# EAGLE design Adafruit UDA1334 I2S DAC (EAGLE 6.4)
COMPANY: ADAFRUIT INDUSTRIES; DRAWN: KTOWN; REV: A; YEAR: 2017
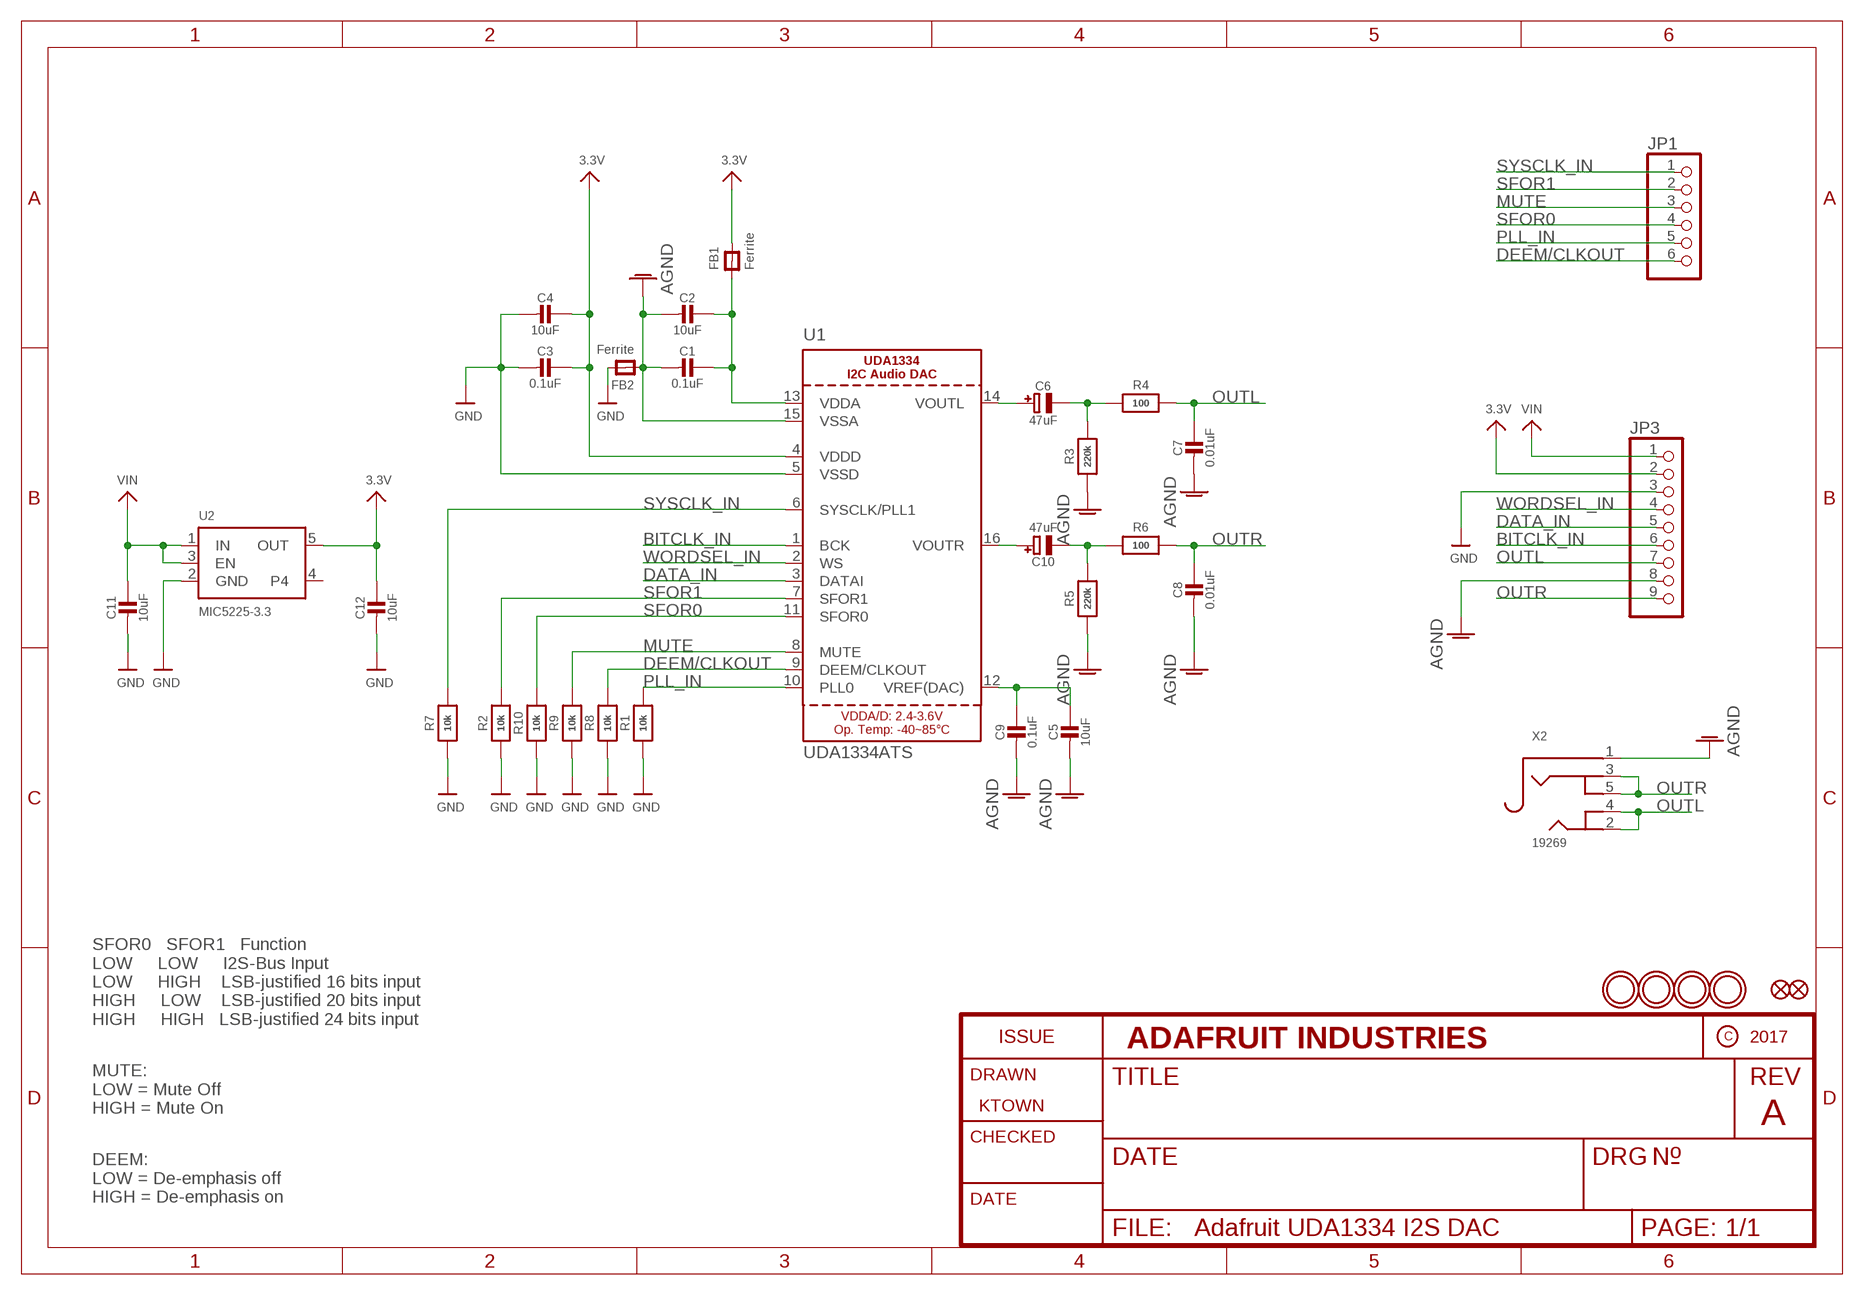
[diagram p0: schematic, sheet 1]

## Parts
C1  0.1uF  CAP_CERAMIC0805-NOOUTLINE  [0805-NO]
C2  10uF  CAP_CERAMIC0805-NOOUTLINE  [0805-NO]
C3  0.1uF  CAP_CERAMIC0805-NOOUTLINE  [0805-NO]
C4  10uF  CAP_CERAMIC0805-NOOUTLINE  [0805-NO]
C5  10uF  CAP_CERAMIC0805-NOOUTLINE  [0805-NO]
C6  47uF  CAP_ELECTROLYTICPANASONIC_C  [PANASONIC_C]
C7  0.01uF  CAP_CERAMIC0805-NOOUTLINE  [0805-NO]
C8  0.01uF  CAP_CERAMIC0805-NOOUTLINE  [0805-NO]
C9  0.1uF  CAP_CERAMIC0805-NOOUTLINE  [0805-NO]
C10  47uF  CAP_ELECTROLYTICPANASONIC_C  [PANASONIC_C]
C11  10uF  CAP_CERAMIC0805-NOOUTLINE  [0805-NO]
C12  10uF  CAP_CERAMIC0805-NOOUTLINE  [0805-NO]
FB1  Ferrite  FERRITE0805  [0805]
FB2  Ferrite  FERRITE0805  [0805]
FID1  FIDUCIAL_1MM  [FIDUCIAL_1MM]
FID2  FIDUCIAL_1MM  [FIDUCIAL_1MM]
JP1  HEADER-1X670MIL  [1X06_ROUND_70]
JP3  HEADER-1X970MIL  [1X09_ROUND_70]
R1  10k  RESISTOR_0603_NOOUT  [0603-NO]
R2  10k  RESISTOR_0603_NOOUT  [0603-NO]
R3  220k  RESISTOR0805_NOOUTLINE  [0805-NO]
R4  100  RESISTOR0805_NOOUTLINE  [0805-NO]
R5  220k  RESISTOR0805_NOOUTLINE  [0805-NO]
R6  100  RESISTOR0805_NOOUTLINE  [0805-NO]
R7  10k  RESISTOR_0603_NOOUT  [0603-NO]
R8  10k  RESISTOR_0603_NOOUT  [0603-NO]
R9  10k  RESISTOR_0603_NOOUT  [0603-NO]
R10  10k  RESISTOR_0603_NOOUT  [0603-NO]
U1  UDA1334ATS  AUDIO_I2S_UDA1334""  [SSOP16_4.4MM]
U2  MIC5225-3.3  VREG_SOT23-5  [SOT23-5]
U$11  MOUNTINGHOLE2.5  [MOUNTINGHOLE_2.5_PLATED]
U$12  MOUNTINGHOLE2.5  [MOUNTINGHOLE_2.5_PLATED]
U$13  MOUNTINGHOLE2.5  [MOUNTINGHOLE_2.5_PLATED]
U$14  MOUNTINGHOLE2.5  [MOUNTINGHOLE_2.5_PLATED]
X2  19269  AUDIO_3.5MMJACK  [4UCONN_19269]

## Nets
3.3V: C3.1 C4.1 C12.1 FB1.2 JP3.2 U1.4(VDDD) U2.5(OUT)
AGND: C1.2 C2.2 C5.2 C7.2 C8.2 C9.2 FB2.1 JP3.8 R3.1 R5.1 U1.15(VSSA) X2.1
BITCLK_IN: JP3.6 U1.1(BCK)
DATA_IN: JP3.5 U1.3(DATAI)
DEEM/CLKOUT: JP1.6 R8.2 U1.9(DEEM/CLKOUT)
GND: C3.2 C4.2 C11.2 C12.2 FB2.2 JP3.3 R1.1 R2.1 R7.1 R8.1 R9.1 R10.1 U1.5(VSSD) U2.2(GND)
MUTE: JP1.3 R9.2 U1.8(MUTE)
N$1: C5.1 C9.1 U1.12(VREF(DAC))
N$2: C1.1 C2.1 FB1.1 U1.13(VDDA)
N$3: C10.+ U1.16(VOUTR)
N$4: C6.+ U1.14(VOUTL)
N$7: C6.- R3.2 R4.1
N$8: C10.- R5.2 R6.1
OUTL: C7.1 JP3.7 R4.2 X2.2 X2.4
OUTR: C8.1 JP3.9 R6.2 X2.3 X2.5
PLL_IN: JP1.5 R1.2 U1.10(PLL0)
SFOR0: JP1.4 R10.2 U1.11(SFOR0)
SFOR1: JP1.2 R2.2 U1.7(SFOR1)
SYSCLK_IN: JP1.1 R7.2 U1.6(SYSCLK/PLL1)
VIN: C11.1 JP3.1 U2.1(IN) U2.3(EN)
WORDSEL_IN: JP3.4 U1.2(WS)
Unconnected: U2.4

## Notes on the sheet
- SFOR0   SFOR1   Function
  LOW     LOW     I2S-Bus Input
  LOW     HIGH    LSB-justified 16 bits input 
  HIGH     LOW    LSB-justified 20 bits input 
  HIGH     HIGH   LSB-justified 24 bits input
- MUTE:
  LOW = Mute Off
  HIGH = Mute On
- DEEM:
  LOW = De-emphasis off
  HIGH = De-emphasis on

## Library data of the parts
C1-C5 C7-C9 C11 C12 = microbuilder:CAP_CERAMIC: Ceramic Capacitors For new designs, use the packages preceded by an '_' character since they are more reliable: The following footprints should be used on most boards: _0402 - Standard footprint for regular board layouts _0603 - Standard footprint for regular board layouts _0805 - Standard footprint for regular board layouts _1206 - Standard footprint for regular board layouts For extremely tight-pitch boards where space is at a premium, the following 'micro-pitch' footprints can be used (smaller pads, no silkscreen outline, etc.): _0402MP - Micro-pitch footprint for very dense/compact boards _0603MP - Micro-pitch footprint for very dense/compact boards _0805MP - Micro-pitch footprint for very dense/compact boards _1206MP - Micro-pitch footprint for very dense/compact boards
C6 C10 = microbuilder:CAP_ELECTROLYTIC: Electrolytic Capacitors SMT PANASONIC_C - Size C Panasonic Electrolytic Aluminum Capacitor 47µF 16V 20% Electrolytic Capacitor [Digikey: PCE3890TR-ND] PANASONIC_D - Size D Panasonic Electrolytic Aluminum Capacitor 100µF 25V 20% Electrolytic Capacitor [Digikey: PCE3898TR-ND] PTH 3.5 mm grid, 8 mm diameter ... 3.5 mm grid, 10 mm diameter ...
FB1 FB2 = microbuilder:FERRITE: Ferrite Bead 0603 MMZ1608B121C - 120 Ohm @ 100MHz, 600mA, 0.15 Ohm DC Resistance - Digikey: 445-2164-1-ND BK1608HW121-T - 120 Ohm, 600mA Ferrite Chip - Digikey: 587-1876-2-ND 0805 HZ0805B272R-10 - 2.7K Ohm @ 100MHz, 200mA, 0.8 Ohm DC Resistance - Digikey: 240-2504-1-ND (see also Murata BLM21BD272SN1L) MMZ2012Y152B - 1.5K Ohm @ 100MHz, 500mA, 0.4 Ohm DC Resistance - Digikey: 445-1560-1-ND - Mainly for high frequency (80-400MHz) MMZ2012R102A - 1K Ohm @ 100MHz, 500mA, 0.3 Ohm DC Resistance - Digikey: 445-1555-2-ND - More general purpose (10-200MHz)
FID1 FID2 = microbuilder:FIDUCIAL: Fiducial Alignment Points Various fiducial points for machine vision alignment.; BOM: EXCLUDE
JP1 = microbuilder:HEADER-1X6: PIN HEADER
JP3 = microbuilder:HEADER-1X9: PIN HEADER
R1-R10 = microbuilder:RESISTOR: Resistors For new designs, use the packages preceded by an '_' character since they are more reliable: The following footprints should be used on most boards: _0402 - Standard footprint for regular board layouts _0603 - Standard footprint for regular board layouts _0805 - Standard footprint for regular board layouts _1206 - Standard footprint for regular board layouts For extremely tight-pitch boards where space is at a premium, the following 'micro-pitch' footprints can be used (smaller pads, no silkscreen outline, etc.): _0402MP - Micro-pitch footprint for very dense/compact boards _0603MP - Micro-pitch footprint for very dense/compact boards _0805MP - Micro-pitch footprint for very dense/compact boards _1206MP - Micro-pitch footprint for very dense/compact boards
U1 = microbuilder:AUDIO_I2S_UDA1334: UDA1334 I2C Audio DAC Power Supply: 2.4-3.6V Sample frequencies from 16-100kHz
U2 = microbuilder:VREG_SOT23-5: SOT23-5 Fixed Voltage Regulators Part Current Out V Out V In V Dropout θJA (°C/W) TJ (°C) Digikey Part No. ADP121 150mA 3.3V 3.4-5.5V 0.09V @ 150mA -- -- ADP121-AUJZ33R7CT-ND ADP121 150mA 3.0V 3.1-5.5V 0.09V @ 150mA -- -- ADP121-AUJZ30R7CT-ND ADP122 300mA 3.3V 3.4-5.5V 0.085V @ 300mA -- -- ADP122AUJZ-3.3-R7CT-ND ADP1712 300mA 3.3V 3.5-5.5V 0.17V @ 300mA -- -- ADP1712AUJZ-3.3-R7TR-ND AP7311 (Low Cost) 150mA 3.3V 3.5-6V 0.15V @ 150mA -- -- AP7311-33WG-7DICT-ND LD39015M18R 150mA 1.8V 1.9V-5.5V 0.08V @ 100mA -- -- 497-6977-1-ND LP2985A-33DBVR 150mA 3.3V 3.3-16V 0.28V @ 150mA 206 150 296-18479-1-ND MCP1824T-3302E/OT 300mA 3.3V 3.5V-6V 0.2V @ 300mA -- -- MCP1824T-3302E/OTCT-ND MIC5205-2.5YM5 TR 150mA 2.5V 2.7-16V 0.165V @ 150mA -- -- 576-1257-2-ND MIC5205-3.0YM5 TR 150mA 3.0V 3.2V-16V 0.165V @ 150mA -- -- 576-1258-2-ND MIC5205-3.3YM5 TR 150mA 3.3V 3.5V-16V 0.165V @ 150mA -- -- 576-1259-2-ND TPS780330220 150mA 3.3V+2.2V 3.6-5.5V 250mV Max -- -- 296-23332-1-ND TDA3663/N1,135 100mA 3.3V 3.5-45V 0.18V @ 50mA -- -- 568-5343-1-ND Max operating temp can be calculated using θJA, TJ (max junction temperature), and power in watts. Set the "Maximum Ambient Temperature" until it reaches TJ ("Max Junction Temperature"), which is the absolute limit for safe use of the regulator: Heat Sink Temperature Calculator <http://www.daycounter.com/Calculators/Heat-Sink-Temperature-Calculator.phtml> For example, With 12V source into a 3.3V LP2985 and a 30mA load, we are dissipating (12V-3.3V) * 0.03A = 0.261W. With a θJA of 206 °C/W, a TJ of 150°C, and 261mW we can safely use the chip without a heat sink up to 75°C (=147.1°C Junction Temperature).
U$11-U$14 = microbuilder:MOUNTINGHOLE: Mounting Hole For #2 screws (0.086"/2.18mm width, 0.094"/2.4mm hole) use 2.5mm; BOM: EXCLUDE
X2 = microbuilder:AUDIO_3.5MMJACK: 3.5MM Audio Jack These are normally connected as follows, from left-to right on the schematic symbol above: Tip: Left Audio Inner Ring: Right Audio Shell: Common/GND

## Board
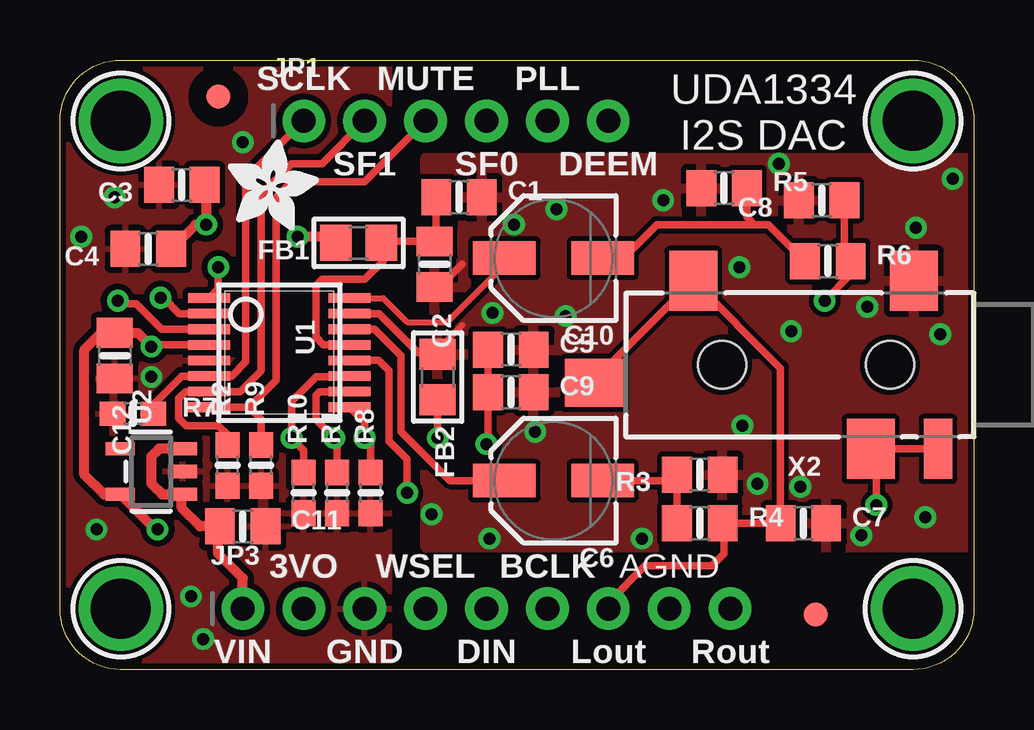
[diagram p1: board, top side]
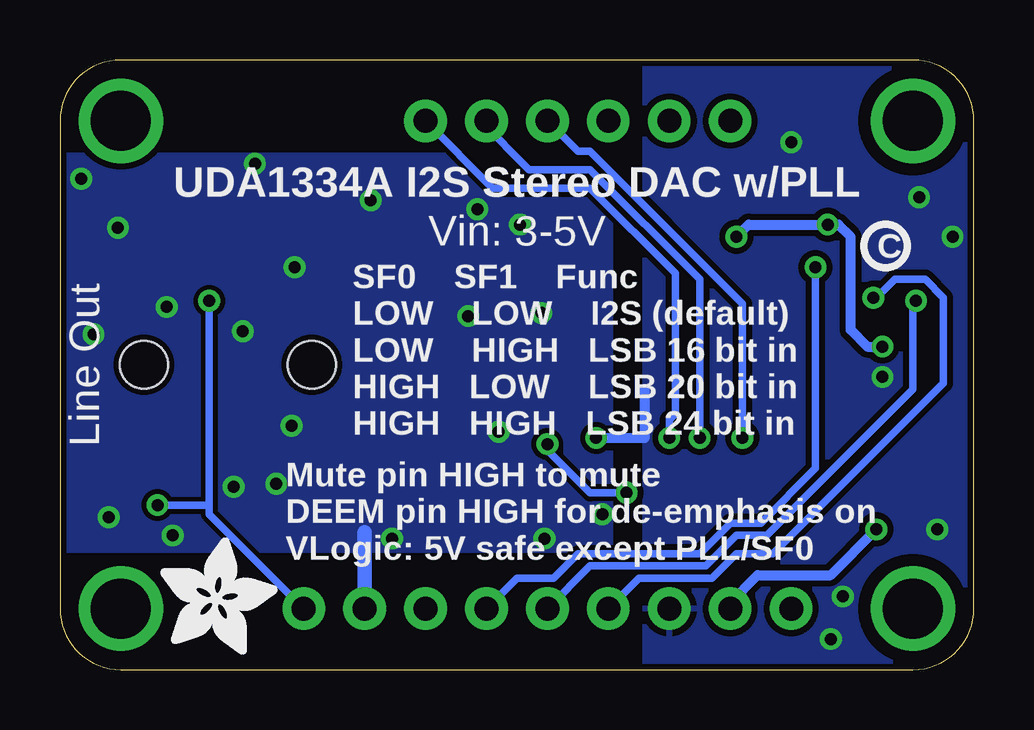
[diagram p2: board, bottom side, seen from below]

Size 38.1 x 25.4 mm. Coordinates in mm from the lower left corner, seen from the top.
Outline: 2.54,25.4 35.56,25.4 arc-90 38.1,22.86 38.1,2.54 arc-90 35.56,0 2.54,0 arc-90 0,2.54 0,22.86 arc-90 2.54,25.4
Copper layers (1*16): Top 0.035mm / dielectric 1.5mm / Bottom 0.035mm
Design rules "adafruit *": minimum track width 8mil, minimum drill 15.5mil, track to track 8mil, track to pad 8mil, pad to pad 8mil, via to via 8mil, smd to smd 8mil, copper to edge 10mil, drill to drill 8mil, minimum pad ring 10mil, minimum via ring 8mil, stop-mask expansion 2mil, vias tented up to drill 20mil, thermal gap 10mil

### Footprints (pad centres in the part's own frame; a part is rotated, then mirrored left to right if it is on the bottom)
0805-NO = smd 1.24 x 1.5: 1 -0.95,0; 2 0.95,0
PANASONIC_C = smd 2.6 x 1.4: + 2.05,0; - -2.05,0
0805 = smd 1.3 x 1.5: 1 -0.95,0; 2 0.95,0
FIDUCIAL_1MM = smd 1 x 1: 1 0,0
1X06_ROUND_70 = drill 1 pad 1.778: 1 -6.35,0; 2 -3.81,0; 3 -1.27,0; 4 1.27,0; 5 3.81,0; 6 6.35,0
1X09_ROUND_70 = drill 1 pad 1.778: 1 -10.16,0; 2 -7.62,0; 3 -5.08,0; 4 -2.54,0; 5 0,0; 6 2.54,0; 7 5.08,0; 8 7.62,0; 9 10.16,0
0603-NO = smd 1.075 x 1: 1 -0.85,0; 2 0.85,0
SSOP16_4.4MM = smd 0.4 x 1.75: 1 -2.275,-2.92; 2 -1.625,-2.92; 3 -0.975,-2.92; 4 -0.325,-2.92; 5 0.325,-2.92; 6 0.975,-2.92; 7 1.625,-2.92; 8 2.275,-2.92; 9 2.275,2.92; 10 1.625,2.92; 11 0.975,2.92; 12 0.325,2.92; 13 -0.325,2.92; 14 -0.975,2.92; 15 -1.625,2.92; 16 -2.275,2.92
SOT23-5 = smd 0.55 x 1.2: 1 -0.95,-1.3; 2 0,-1.3; 3 0.95,-1.3; 4 0.95,1.3; 5 -0.95,1.3
MOUNTINGHOLE_2.5_PLATED = drill 2.5 pad 3.2: P$1 0,0
4UCONN_19269 = smd 2 x 2.5: 1 2.5,-3.5; 2 11.7,-3.5; 3 4.3,3.5 | smd 2.5 x 2: 4 15.8,0.75 | smd 1.2 x 2.5: 5 1.5,3.5 | hole 2: 3.5,0; 10.5,0

### Placement (x,y rotation side)
C1  16.64,19.68 0 top
C2  15.62,16.89 270 top
C3  5.08,20.19 180 top
C4  3.68,17.53 180 top
C5  18.8,13.34 0 top
C6  20.57,7.87 180 top
C7  30.99,6.1 0 top
C8  31.75,19.56 180 top
C9  18.8,11.56 0 top
C10  20.57,17.14 180 top
C11  7.62,5.97 0 top
C12  2.29,13.08 270 top
FB1  12.45,17.78 180 top
FB2  15.75,12.19 270 top
FID1  6.6,23.88 0 top
FID2  31.5,2.29 0 top
JP1  16.51,22.86 0 top
JP3  17.78,2.54 0 top
R1  11.56,7.37 90 top
R2  6.99,8.51 90 top
R3  26.67,8.13 180 top
R4  26.67,6.1 0 top
R5  27.69,20.07 0 top
R6  32,17.02 0 top
R7  3.05,10.67 0 top
R8  12.95,7.37 90 top
R9  8.38,8.51 90 top
R10  10.16,7.37 90 top
U1  9.14,13.21 270 top
U2  3.81,8.26 90 top
U$5  [PCBFEAT-REV-040]  3.68,17.65 0 bottom
U$6  [ADAFRUIT_5MM]  33.91,0.64 0 bottom
U$11  2.54,2.54 0 top
U$12  35.56,2.54 0 top
U$13  2.54,22.86 0 top
U$14  35.56,22.86 0 top
U$29  [ADAFRUIT_3.5MM]  6.99,18.29 0 top
X2  38.1,12.7 180 top

### Tracks (layer width: path | path; a pad name or v marks a point on that pad's centre or on a via)
3.3V  (via drill 0.5)
  Top 0.305: U1.4 3.63,13.53 arc90 v3.81,13.46
  Top 0.406: C4.1 5.65,18.54 v6.1,18.54 6.1,20.13 C3.1 | v3.81,13.46 3.24,14.03 C12.1 1.71,14.03 1.02,13.34 1.02,8.13 1.84,7.3 U2.5 3.97,5.84 v4.06,5.84 | FB1.2 11.24,18.03 v9.91,18.03
  Bottom 0.406: v3.81,13.46 4.45,13.46 5.14,14.16 5.14,18.03 5.65,18.54 v6.1,18.54 9.4,18.54 v9.91,18.03 | JP3.2 10.16,2.79 9.02,3.94 5.97,3.94 v4.06,5.84
AGND  (via drill 0.5)
  Top 0.254: 16.76,14.35 15.75,13.34 FB2.1 15.56,13.14 15.49,13.21
  Top 0.305: U1.15 13.3,14.83 14.93,13.21 15.49,13.21 | C2.2 15.81,15.94 16.76,16.89
  Bottom 0.61: JP3.8 25.4,5.71
  other vias: 28.45,10.16 36.07,6.35 21.08,14.73 25.15,19.56 29.97,21.08 18.03,14.86 15.49,6.48 19.81,9.91 35.69,18.41 33.66,15.11 36.7,13.97 30.86,7.62 33.4,5.59 29.08,7.75 24.26,5.46 17.91,5.46 20.7,19.18 37.21,20.45 28.32,16.76 30.48,14.1 18.92,18.54
  pour Top: 15.24,21.34 38.1,21.34 38.1,5.08 15.24,5.08
  pour Bottom: 15.24,21.34 38.1,21.34 38.1,5.08 15.24,5.08
BITCLK_IN  (via drill 0.5)
  Top 0.305: U1.1 6.6,15.86 v6.6,16.76
  Bottom 0.305: JP3.6 19.05,3.81 17.53,3.81 16.51,4.83 11.43,4.83 10.16,6.1 8.89,6.1 6.6,8.38 v6.6,16.76
DATA_IN  (via drill 0.5)
  Top 0.305: U1.3 4.23,14.18 3.17,15.24 2.54,15.24 v2.41,15.37
  Bottom 0.305: JP3.5 16,4.32 11.18,4.32 9.91,5.59 8.64,5.59 2.54,11.68 2.54,15.24 v2.41,15.37
DEEM/CLKOUT  (via drill 0.5)
  Top 0.305: U1.9 12.7,10.3 v12.7,9.65 12.95,9.4 R8.2
  Bottom 0.305: v12.7,9.65 12.7,10.41 12.45,10.67 12.45,16.51 16,20.07 20.07,20.07 JP1.6
GND  (via drill 0.5)
  Top 0.305: FB2.2 v15.75,9.65
  Bottom 0.406: v15.75,9.65 13.72,9.65 13.72,11.68
  other vias: 7.62,21.97 2.29,19.68 5.97,1.27 0.89,18.03 1.52,5.84 5.46,3.05 3.81,12.19
  pour Bottom (isolate 0.254): 13.72,0 0,0 0,25.4 13.72,25.4
  pour Top (isolate 0.254): 13.72,0 0,0 0,25.4 13.72,25.4
MUTE
  Top 0.305: U1.8 7.88,10.93 | 7.88,10.93 9.02,12.06 9.02,19.68 9.65,20.32 12.7,20.32 JP1.3 | R9.2 8.38,10.44 7.88,10.93
N$1  (via drill 0.5)
  Top 0.305: U1.12 13.28,12.88 13.72,12.45 13.72,9.53 14.48,8.76 v14.48,7.37 | C5.1 C9.1 17.85,9.46 v17.78,9.4
  Bottom 0.305: v14.48,7.37 16,7.37 17.78,9.14 v17.78,9.4
N$2
  Top 0.305: U1.13 10.98,13.53 10.67,13.84 10.67,16 10.92,16.26 12.7,16.26 13.46,17.02 13.46,17.85 | 13.46,17.85 FB1.1 | 13.46,17.85 C2.1 15.69,17.91 C1.1
N$3
  Top 0.254: U1.16 13.47,15.48 14.48,14.48 16.13,14.48 18.52,16.87 C10.+
N$4
  Top 0.305: C6.+ 16.26,7.87 14.22,9.91 14.22,13.08 13.12,14.18 U1.14
N$7
  Top 0.305: C6.- 25.47,7.87 R3.2 R4.1
N$8
  Top 0.254: 23.62,17.27 23.5,17.14 C10.-
  Top 0.305: 23.62,17.27 24.89,18.54 28.96,18.54 | 28.96,18.54 29.53,18.54 R6.1 | R5.2 28.64,18.86 28.96,18.54
OUTL
  Top 0.305: JP3.7 22.86,2.79 24.38,4.32 27.18,4.32 27.69,4.83 27.69,6.03 R4.2 C7.1 30.04,12.56 X2.2 22.3,12.1 X2.4
OUTR  (via drill 0.5)
  Top 0.305: X2.5 X2.3 34.04,8.96 v34.04,6.86 | C8.1 32.7,17.27 R6.2 32.95,16.44 v31.88,15.37
  Bottom 0.305: v31.88,15.37 31.88,6.86 | 31.88,6.86 31.88,6.48 JP3.9 | v34.04,6.86 31.88,6.86
PLL_IN  (via drill 0.5)
  Top 0.305: U1.10 10.82,11.58 10.67,11.43 10.67,10.41 v11.43,9.65 11.49,9.65 11.56,9.59 R1.2
  Bottom 0.305: v11.43,9.65 11.43,16.26 16,20.83 18.54,20.83 20.57,22.86 JP1.5
SFOR0  (via drill 0.5)
  Top 0.305: U1.11 12.02,12.19 10.67,12.19 9.65,11.18 v9.65,9.65 10.16,9.14 R10.2
  Bottom 0.305: JP1.4 16.51,21.59 16,21.59 9.65,15.24 v9.65,9.65
SFOR1
  Top 0.305: R2.2 6.99,9.78 6.6,10.16 5.27,10.16 4.95,10.47 4.95,11.3 5.23,11.58 U1.7 7.52,11.58 8.38,12.45 8.38,19.81 9.65,21.08 10.92,21.08 JP1.2
SYSCLK_IN
  Top 0.305: JP1.1 7.75,20.45 7.75,12.83 7.15,12.23 U1.6 5.08,12.23 3.9,11.05 R7.2
VIN
  Top 0.406: U2.3 4.12,9.21 3.81,8.89 3.81,7.75 4.25,7.3 U2.1 5.08,7.28 5.08,6.73 5.84,5.97 C11.1 6.6,5.9 6.6,4.83 7.62,3.81 JP3.1
WORDSEL_IN  (via drill 0.5)
  Top 0.305: U1.2 4.98,14.83 4.32,15.49 v4.19,15.49
  Bottom 0.305: JP3.4 13.97,3.81 10.92,3.81 9.91,4.83 8.38,4.83 1.27,11.94 1.27,15.49 2.03,16.26 3.3,16.26 4.06,15.49 v4.19,15.49

### Text on the board
tPlace: SCLK | MUTE | PLL | UDA1334 / I2S DAC | SF1 | SF0 | DEEM | 3VO | WSEL | BCLK | AGND | VIN | GND | DIN | Lout | Rout
bPlace: UDA1334A I2S Stereo DAC w/PLL | Vin: 3-5V | Line Out | SF0 SF1 Func / LOW LOW I2S (default) / LOW HIGH LSB 16 bit in / HIGH LOW LSB 20 bit in / HIGH HIGH LSB 24 bit in | Mute pin HIGH to mute / DEEM pin HIGH for de-emphasis on / VLogic: 5V safe except PLL/SF0